# EAGLE board all (EAGLE 6.2), part 1 of 2
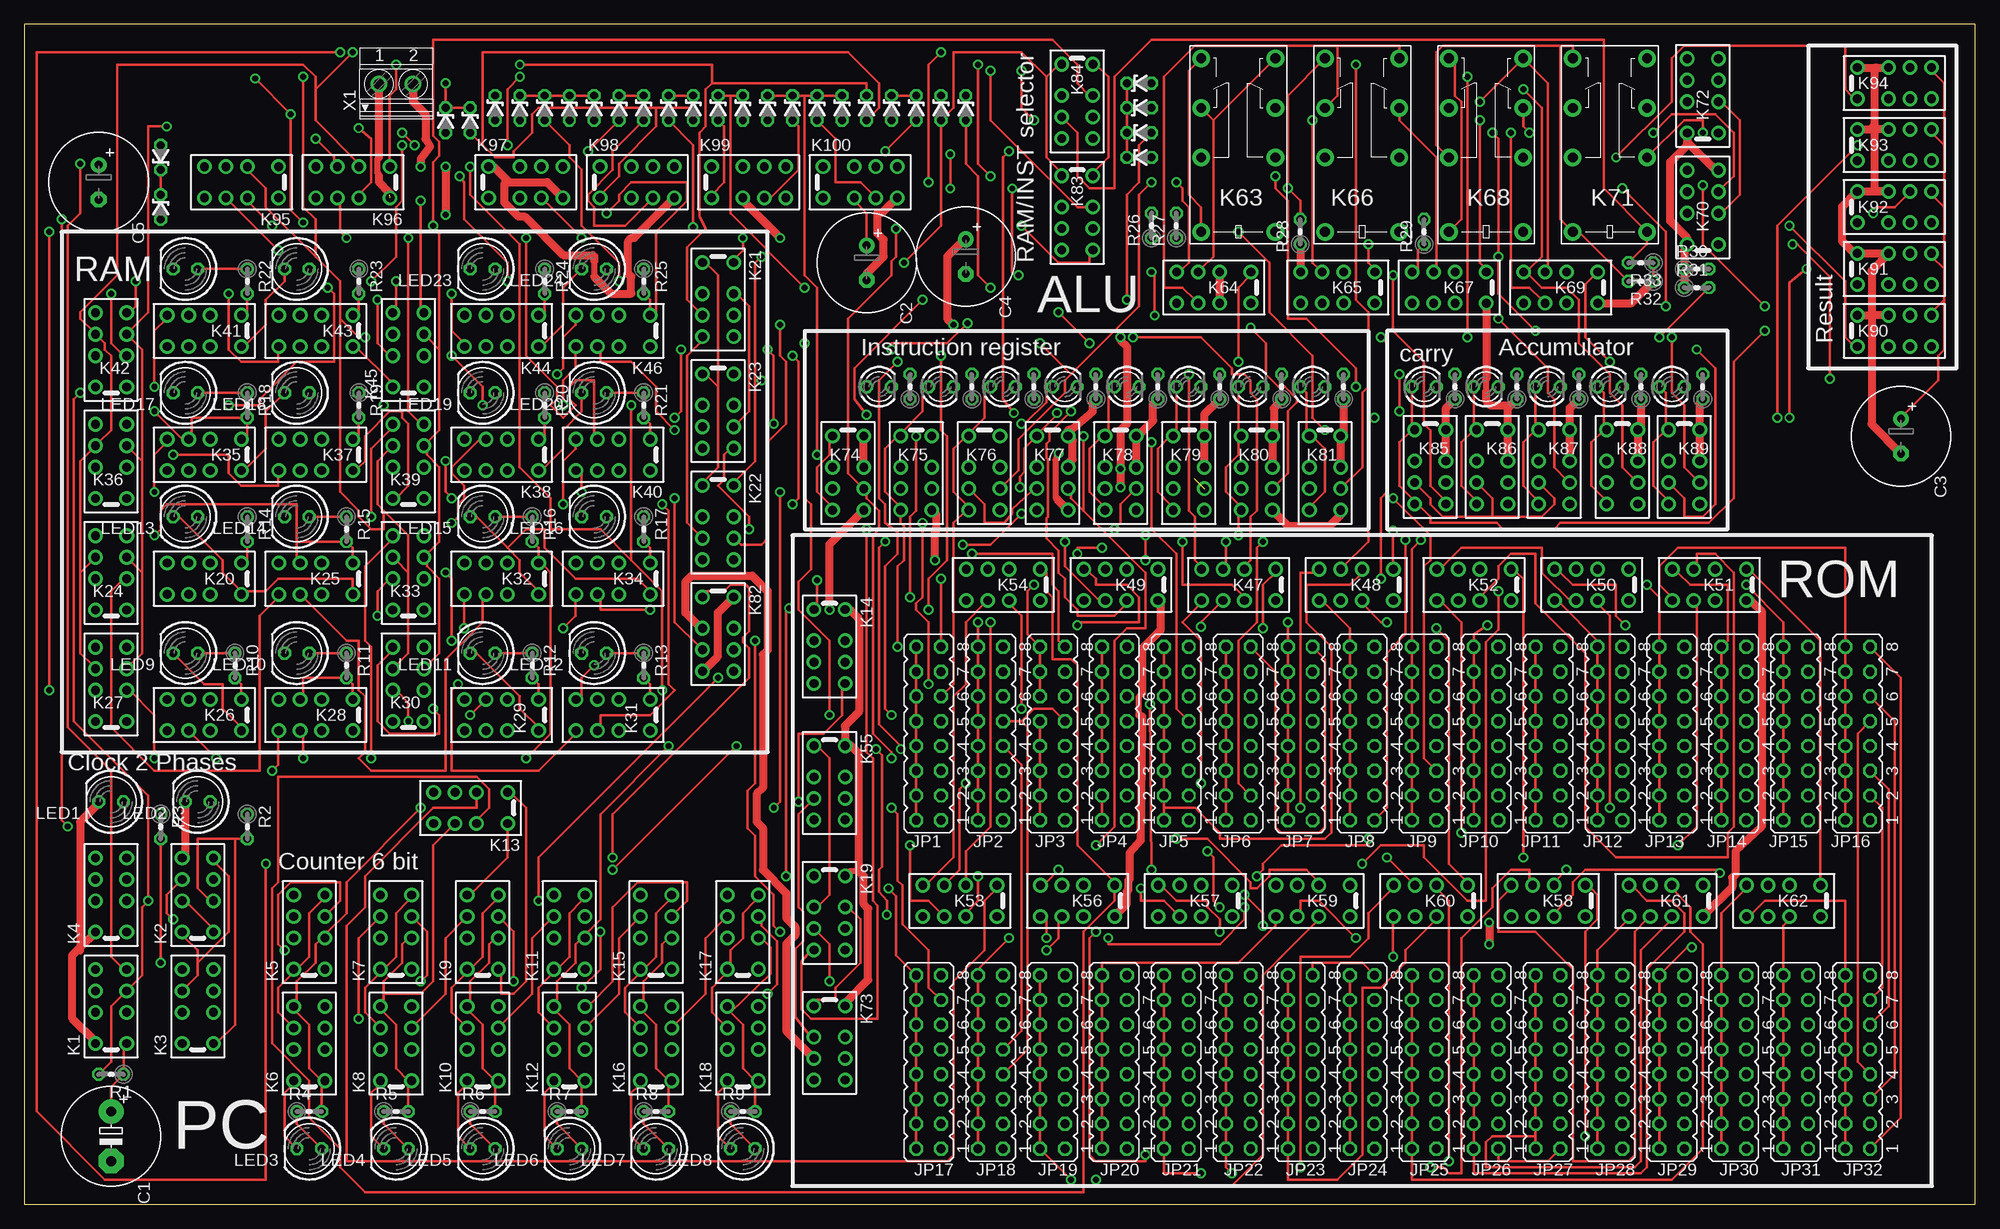
[diagram p6: board, top side]
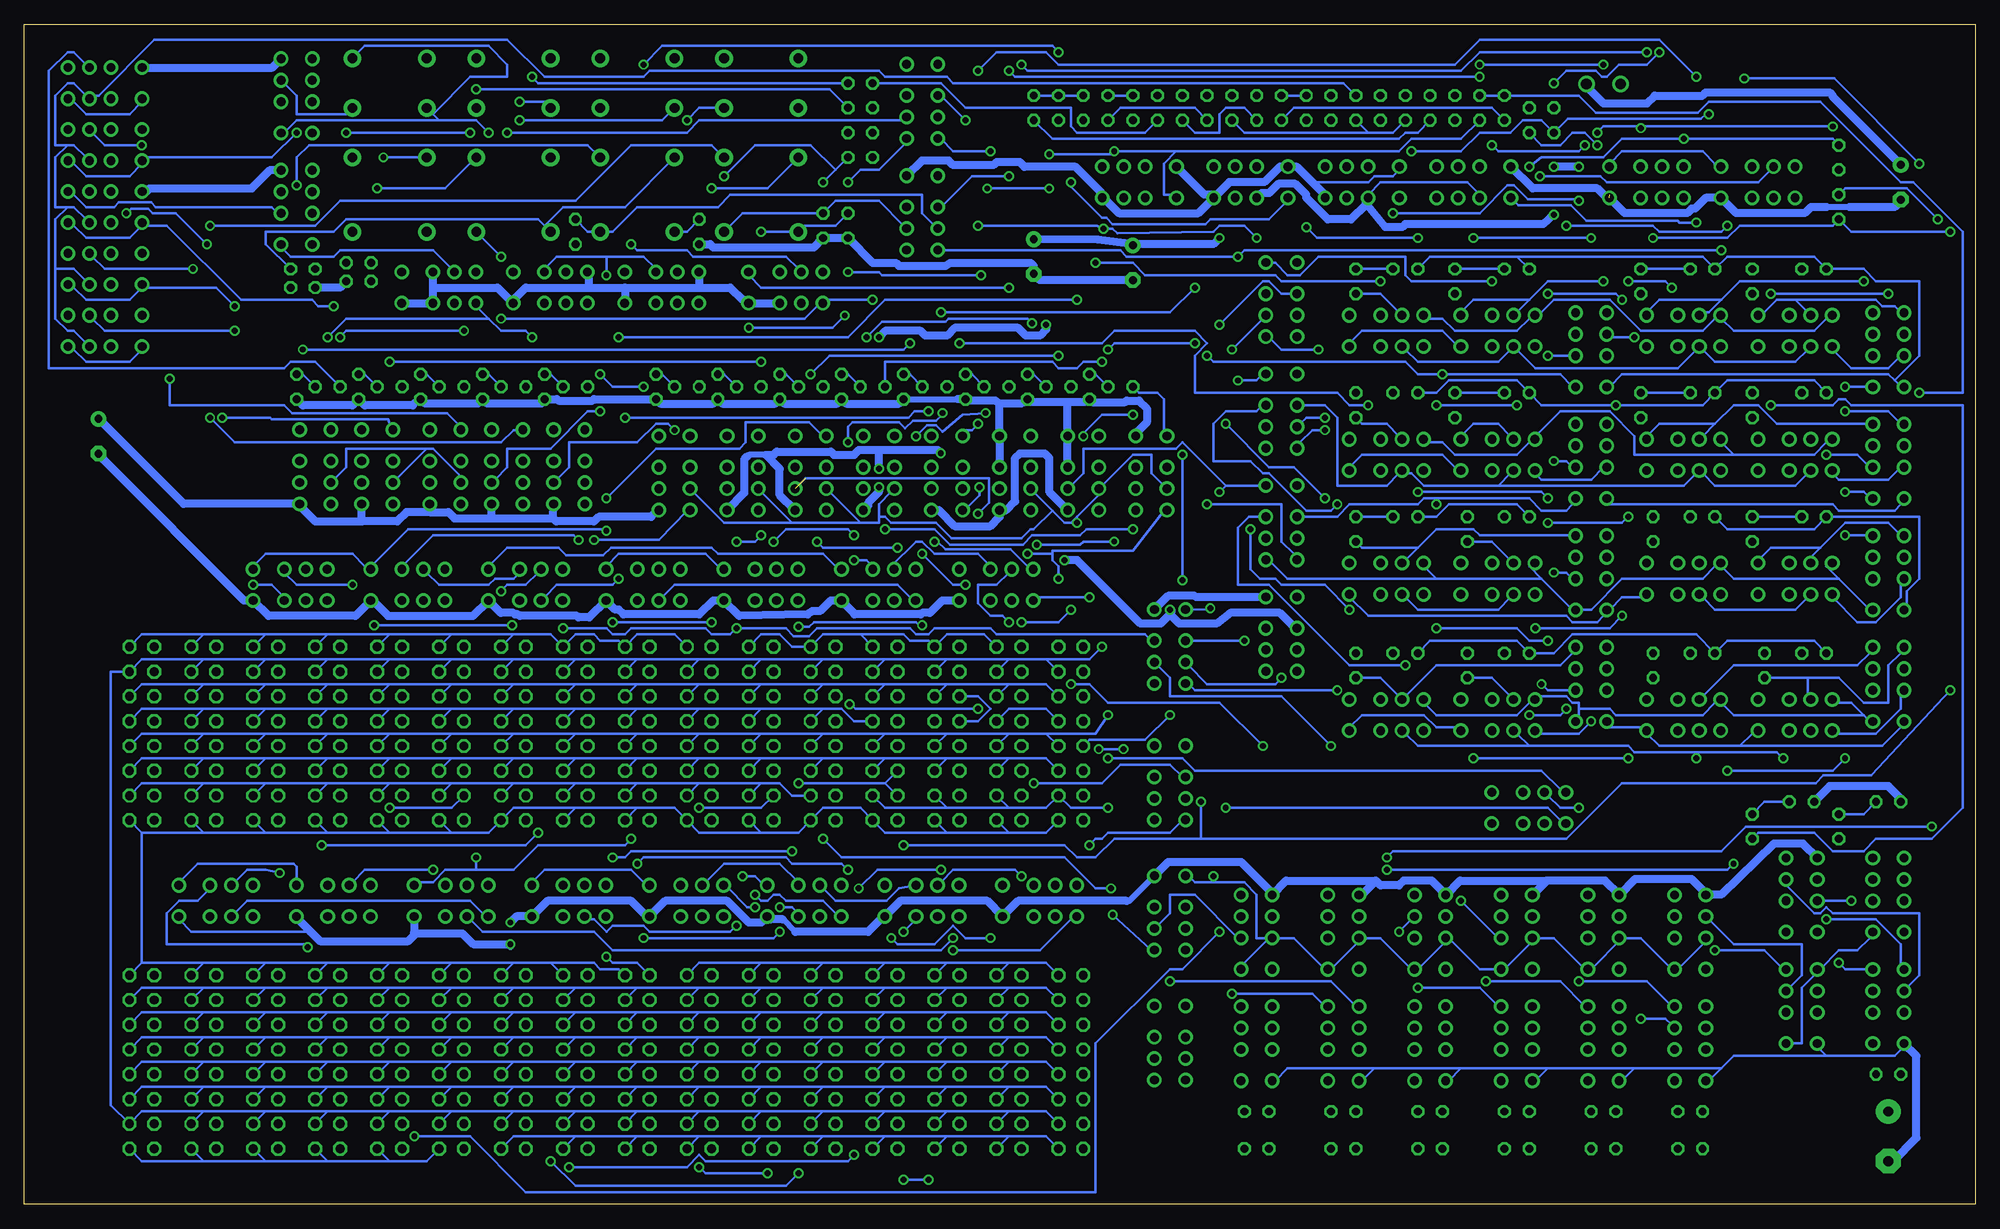
[diagram p7: board, bottom side, seen from below]

Size 200.01 x 120.95 mm. Coordinates in mm from the lower left corner, seen from the top.
Outline: 0,0 200.01,0 200.01,120.95 0,120.95 0,0
Copper layers (1*16): Top 0.035mm / dielectric 1.5mm / Bottom 0.035mm
Design rules: minimum track width 10mil, minimum drill 24mil, track to track 8mil, track to pad 8mil, pad to pad 8mil, via to via 8mil, smd to smd 8mil, copper to edge 40mil, drill to drill 8mil, minimum pad ring 10mil, minimum via ring 8mil, stop-mask expansion 4mil, vias tented up to drill 0mil, thermal gap 10mil

## Footprints (pad centres in the part's own frame; a part is rotated, then mirrored left to right if it is on the bottom)
E5-10,5 = drill 1.016 pad 2.54: + -2.54,0 | drill 1.016 pad 2.54 octagon: - 2.54,0
E3,5-10 = drill 0.813 pad 1.6: + -1.778,0 | drill 0.813 pad 1.6 octagon: - 1.778,0
ZDIO-2.5 = drill 0.813 octagon: A 1.27,0; C -1.27,0
JP8Q = drill 0.914 octagon: 1 -8.89,-1.27; 2 -8.89,1.27; 3 -6.35,-1.27; 4 -6.35,1.27; 5 -3.81,-1.27; 6 -3.81,1.27; 7 -1.27,-1.27; 8 -1.27,1.27; 9 1.27,-1.27; 10 1.27,1.27; 11 3.81,-1.27; 12 3.81,1.27; 13 6.35,-1.27; 14 6.35,1.27; 15 8.89,-1.27; 16 8.89,1.27
G6J-2P-Y = drill 0.9 pad 1.5: 1 -3.2,-1.6; 2 0,-1.6; 3 2.2,-1.6; 4 4.4,-1.6; 5 4.4,1.6; 6 2.2,1.6; 7 0,1.6; 8 -3.2,1.6
G5V-2 = drill 1 pad 1.8: 1 -8.89,-3.81; 4 -1.27,-3.81; 6 3.81,-3.81; 8 8.89,-3.81; 9 8.89,3.81; 11 3.81,3.81; 13 -1.27,3.81; 16 -8.89,3.81
LED5MM = drill 0.813 octagon: A -1.27,0; K 1.27,0
LED3MM = drill 0.813 octagon: A -1.27,0; K 1.27,0
0204V = drill 0.813 octagon: 1 -1.27,0; 2 1.27,0
1751248 = drill 1.1 pad 1.7: 1 -1.75,-0.1; 2 1.75,-0.1

## Placement (x,y rotation side)
C1  1000uF  [E5-10,5]  8.89,6.98 270 top
C2  1000uF  [E3,5-10]  86.36,96.52 270 top
C3  1000uF  [E3,5-10]  192.41,78.74 270 top
C4  1000uF  [E3,5-10]  96.52,97.16 270 top
C5  1000uF  [E3,5-10]  7.62,104.78 270 top
D1  1N4004VERTICALE  [ZDIO-2.5]  13.97,102.23 270 top
D2  1N4004VERTICALE  [ZDIO-2.5]  13.97,107.32 90 top
D3  1N4004VERTICALE  [ZDIO-2.5]  114.3,114.94 0 top
D4  1N4004VERTICALE  [ZDIO-2.5]  114.3,112.4 0 top
D5  1N4004VERTICALE  [ZDIO-2.5]  114.3,109.86 0 top
D6  1N4004VERTICALE  [ZDIO-2.5]  114.3,107.32 0 top
D29  1N4004VERTICALE  [ZDIO-2.5]  43.18,111.12 270 top
D30  1N4004VERTICALE  [ZDIO-2.5]  45.72,111.12 270 top
D31  1N4004VERTICALE  [ZDIO-2.5]  48.26,112.4 270 top
D32  1N4004VERTICALE  [ZDIO-2.5]  50.8,112.4 270 top
D33  1N4004VERTICALE  [ZDIO-2.5]  53.34,112.4 270 top
D34  1N4004VERTICALE  [ZDIO-2.5]  55.88,112.4 270 top
D35  1N4004VERTICALE  [ZDIO-2.5]  58.42,112.4 270 top
D36  1N4004VERTICALE  [ZDIO-2.5]  60.96,112.4 270 top
D37  1N4004VERTICALE  [ZDIO-2.5]  63.5,112.4 270 top
D38  1N4004VERTICALE  [ZDIO-2.5]  66.04,112.4 270 top
D39  1N4004VERTICALE  [ZDIO-2.5]  68.58,112.4 270 top
D40  1N4004VERTICALE  [ZDIO-2.5]  71.12,112.4 270 top
D41  1N4004VERTICALE  [ZDIO-2.5]  73.66,112.4 270 top
D42  1N4004VERTICALE  [ZDIO-2.5]  76.2,112.4 270 top
D43  1N4004VERTICALE  [ZDIO-2.5]  78.74,112.4 270 top
D44  1N4004VERTICALE  [ZDIO-2.5]  81.28,112.4 270 top
D45  1N4004VERTICALE  [ZDIO-2.5]  83.82,112.4 270 top
D46  1N4004VERTICALE  [ZDIO-2.5]  86.36,112.4 270 top
D47  1N4004VERTICALE  [ZDIO-2.5]  88.9,112.4 270 top
D48  1N4004VERTICALE  [ZDIO-2.5]  91.44,112.4 270 top
D49  1N4004VERTICALE  [ZDIO-2.5]  93.98,112.4 270 top
D50  1N4004VERTICALE  [ZDIO-2.5]  96.52,112.4 270 top
JP1  [JP8Q]  92.71,48.26 90 top
JP2  [JP8Q]  99.06,48.26 90 top
JP3  [JP8Q]  105.41,48.26 90 top
JP4  [JP8Q]  111.76,48.26 90 top
JP5  [JP8Q]  118.11,48.26 90 top
JP6  [JP8Q]  124.46,48.26 90 top
JP7  [JP8Q]  130.81,48.26 90 top
JP8  [JP8Q]  137.16,48.26 90 top
JP9  [JP8Q]  143.51,48.26 90 top
JP10  [JP8Q]  149.86,48.26 90 top
JP11  [JP8Q]  156.21,48.26 90 top
JP12  [JP8Q]  162.56,48.26 90 top
JP13  [JP8Q]  168.91,48.26 90 top
JP14  [JP8Q]  175.26,48.26 90 top
JP15  [JP8Q]  181.61,48.26 90 top
JP16  [JP8Q]  187.96,48.26 90 top
JP17  [JP8Q]  92.71,14.61 90 top
JP18  [JP8Q]  99.06,14.61 90 top
JP19  [JP8Q]  105.41,14.61 90 top
JP20  [JP8Q]  111.76,14.61 90 top
JP21  [JP8Q]  118.11,14.61 90 top
JP22  [JP8Q]  124.46,14.61 90 top
JP23  [JP8Q]  130.81,14.61 90 top
JP24  [JP8Q]  137.16,14.61 90 top
JP25  [JP8Q]  143.51,14.61 90 top
JP26  [JP8Q]  149.86,14.61 90 top
JP27  [JP8Q]  156.21,14.61 90 top
JP28  [JP8Q]  162.56,14.61 90 top
JP29  [JP8Q]  168.91,14.61 90 top
JP30  [JP8Q]  175.26,14.61 90 top
JP31  [JP8Q]  181.61,14.61 90 top
JP32  [JP8Q]  187.96,14.61 90 top
K1  G6J-2P-Y  [G6J-2P-Y]  8.89,19.69 90 top
K2  G6J-2P-Y  [G6J-2P-Y]  17.78,31.12 90 top
K3  G6J-2P-Y  [G6J-2P-Y]  17.78,19.69 90 top
K4  G6J-2P-Y  [G6J-2P-Y]  8.89,31.12 90 top
K5  G6J-2P-Y  [G6J-2P-Y]  29.21,27.31 90 top
K6  G6J-2P-Y  [G6J-2P-Y]  29.21,15.88 90 top
K7  G6J-2P-Y  [G6J-2P-Y]  38.1,27.31 90 top
K8  G6J-2P-Y  [G6J-2P-Y]  38.1,15.88 90 top
K9  G6J-2P-Y  [G6J-2P-Y]  46.99,27.31 90 top
K10  G6J-2P-Y  [G6J-2P-Y]  46.99,15.88 90 top
K11  G6J-2P-Y  [G6J-2P-Y]  55.88,27.31 90 top
K12  G6J-2P-Y  [G6J-2P-Y]  55.88,15.88 90 top
K13  G6J-2P-Y  [G6J-2P-Y]  46.36,40.64 180 top
K14  G6J-2P-Y  [G6J-2P-Y]  82.55,57.78 270 top
K15  G6J-2P-Y  [G6J-2P-Y]  64.77,27.31 90 top
K16  G6J-2P-Y  [G6J-2P-Y]  64.77,15.88 90 top
K17  G6J-2P-Y  [G6J-2P-Y]  73.66,27.31 90 top
K18  G6J-2P-Y  [G6J-2P-Y]  73.66,15.88 90 top
K19  G6J-2P-Y  [G6J-2P-Y]  82.55,30.48 270 top
K20  G6J-2P-Y  [G6J-2P-Y]  19.05,64.14 180 top
K21  G6J-2P-Y  [G6J-2P-Y]  71.12,93.34 270 top
K22  G6J-2P-Y  [G6J-2P-Y]  71.12,70.48 270 top
K23  G6J-2P-Y  [G6J-2P-Y]  71.12,81.92 270 top
K24  G6J-2P-Y  [G6J-2P-Y]  8.89,64.14 90 top
K25  G6J-2P-Y  [G6J-2P-Y]  30.48,64.14 180 top
K26  G6J-2P-Y  [G6J-2P-Y]  19.05,50.16 180 top
K27  G6J-2P-Y  [G6J-2P-Y]  8.89,52.7 90 top
K28  G6J-2P-Y  [G6J-2P-Y]  30.48,50.16 180 top
K29  G6J-2P-Y  [G6J-2P-Y]  49.53,50.16 180 top
K30  G6J-2P-Y  [G6J-2P-Y]  39.37,52.7 90 top
K31  G6J-2P-Y  [G6J-2P-Y]  60.96,50.16 180 top
K32  G6J-2P-Y  [G6J-2P-Y]  49.53,64.14 180 top
K33  G6J-2P-Y  [G6J-2P-Y]  39.37,64.14 90 top
K34  G6J-2P-Y  [G6J-2P-Y]  60.96,64.14 180 top
K35  G6J-2P-Y  [G6J-2P-Y]  19.05,76.84 180 top
K36  G6J-2P-Y  [G6J-2P-Y]  8.89,75.57 90 top
K37  G6J-2P-Y  [G6J-2P-Y]  30.48,76.84 180 top
K38  G6J-2P-Y  [G6J-2P-Y]  49.53,76.84 180 top
K39  G6J-2P-Y  [G6J-2P-Y]  39.37,75.57 90 top
K40  G6J-2P-Y  [G6J-2P-Y]  60.96,76.84 180 top
K41  G6J-2P-Y  [G6J-2P-Y]  19.05,89.54 180 top
K42  G6J-2P-Y  [G6J-2P-Y]  8.89,87 90 top
K43  G6J-2P-Y  [G6J-2P-Y]  30.48,89.54 180 top
K44  G6J-2P-Y  [G6J-2P-Y]  49.53,89.54 180 top
K45  G6J-2P-Y  [G6J-2P-Y]  39.37,87 90 top
K46  G6J-2P-Y  [G6J-2P-Y]  60.96,89.54 180 top
K47  G6J-2P-Y  [G6J-2P-Y]  125.09,63.5 180 top
K48  G6J-2P-Y  [G6J-2P-Y]  137.16,63.5 180 top
K49  G6J-2P-Y  [G6J-2P-Y]  113.03,63.5 180 top
K50  G6J-2P-Y  [G6J-2P-Y]  161.29,63.5 180 top
K51  G6J-2P-Y  [G6J-2P-Y]  173.36,63.5 180 top
K52  G6J-2P-Y  [G6J-2P-Y]  149.23,63.5 180 top
K53  G6J-2P-Y  [G6J-2P-Y]  96.52,31.12 180 top
K54  G6J-2P-Y  [G6J-2P-Y]  100.96,63.5 180 top
K55  G6J-2P-Y  [G6J-2P-Y]  82.55,43.81 270 top
K56  G6J-2P-Y  [G6J-2P-Y]  108.58,31.12 180 top
K57  G6J-2P-Y  [G6J-2P-Y]  120.65,31.12 180 top
K58  G6J-2P-Y  [G6J-2P-Y]  156.84,31.12 180 top
K59  G6J-2P-Y  [G6J-2P-Y]  132.72,31.12 180 top
K60  G6J-2P-Y  [G6J-2P-Y]  144.78,31.12 180 top
K61  G6J-2P-Y  [G6J-2P-Y]  168.91,31.12 180 top
K62  G6J-2P-Y  [G6J-2P-Y]  180.98,31.12 180 top
K63  G5V-2  [G5V-2]  124.46,108.59 90 top
K64  G6J-2P-Y  [G6J-2P-Y]  122.55,93.98 180 top
K65  G6J-2P-Y  [G6J-2P-Y]  135.26,93.98 180 top
K66  G5V-2  [G5V-2]  137.16,108.59 90 top
K67  G6J-2P-Y  [G6J-2P-Y]  146.69,93.98 180 top
K68  G5V-2  [G5V-2]  149.86,108.59 90 top
K69  G6J-2P-Y  [G6J-2P-Y]  158.12,93.98 180 top
K70  G6J-2P-Y  [G6J-2P-Y]  172.09,101.6 90 top
K71  G5V-2  [G5V-2]  162.56,108.59 90 top
K72  G6J-2P-Y  [G6J-2P-Y]  172.09,113.03 90 top
K73  G6J-2P-Y  [G6J-2P-Y]  82.55,17.15 270 top
K74  G6J-2P-Y  [G6J-2P-Y]  84.45,75.57 270 top
K75  G6J-2P-Y  [G6J-2P-Y]  91.44,75.57 270 top
K76  G6J-2P-Y  [G6J-2P-Y]  98.42,75.57 270 top
K77  G6J-2P-Y  [G6J-2P-Y]  105.41,75.57 270 top
K78  G6J-2P-Y  [G6J-2P-Y]  112.39,75.57 270 top
K79  G6J-2P-Y  [G6J-2P-Y]  119.38,75.57 270 top
K80  G6J-2P-Y  [G6J-2P-Y]  126.36,75.57 270 top
K81  G6J-2P-Y  [G6J-2P-Y]  133.35,75.57 270 top
K82  G6J-2P-Y  [G6J-2P-Y]  71.12,59.05 270 top
K83  G6J-2P-Y  [G6J-2P-Y]  107.95,102.23 270 top
K84  G6J-2P-Y  [G6J-2P-Y]  107.95,113.67 270 top
K85  G6J-2P-Y  [G6J-2P-Y]  144.15,76.2 270 top
K86  G6J-2P-Y  [G6J-2P-Y]  150.5,76.2 270 top
K87  G6J-2P-Y  [G6J-2P-Y]  156.84,76.2 270 top
K88  G6J-2P-Y  [G6J-2P-Y]  163.83,76.2 270 top
K89  G6J-2P-Y  [G6J-2P-Y]  170.18,76.2 270 top
K90  G6J-2P-Y  [G6J-2P-Y]  191.14,89.54 0 top
K91  G6J-2P-Y  [G6J-2P-Y]  191.14,95.89 0 top
K92  G6J-2P-Y  [G6J-2P-Y]  191.14,102.23 0 top
K93  G6J-2P-Y  [G6J-2P-Y]  191.14,108.59 0 top
K94  G6J-2P-Y  [G6J-2P-Y]  191.14,114.94 0 top
K95  G6J-2P-Y  [G6J-2P-Y]  22.86,104.78 180 top
K96  G6J-2P-Y  [G6J-2P-Y]  34.29,104.78 180 top
K97  G6J-2P-Y  [G6J-2P-Y]  50.8,104.78 0 top
K98  G6J-2P-Y  [G6J-2P-Y]  62.23,104.78 0 top
K99  G6J-2P-Y  [G6J-2P-Y]  73.66,104.78 0 top
K100  G6J-2P-Y  [G6J-2P-Y]  85.09,104.78 0 top
LED1  [LED5MM]  8.89,41.27 180 top
LED2  [LED5MM]  17.78,41.27 180 top
LED3  [LED5MM]  29.21,5.71 180 top
LED4  [LED5MM]  38.1,5.71 180 top
LED5  [LED5MM]  46.99,5.71 180 top
LED6  [LED5MM]  55.88,5.71 180 top
LED7  [LED5MM]  64.77,5.71 180 top
LED8  [LED5MM]  73.66,5.71 180 top
LED9  [LED5MM]  16.51,56.52 180 top
LED10  [LED5MM]  27.94,56.52 180 top
LED11  [LED5MM]  46.99,56.52 180 top
LED12  [LED5MM]  58.42,56.52 180 top
LED13  [LED5MM]  16.51,70.48 180 top
LED14  [LED5MM]  27.94,70.48 180 top
LED15  [LED5MM]  46.99,70.48 180 top
LED16  [LED5MM]  58.42,70.48 180 top
LED17  [LED5MM]  16.51,83.19 180 top
LED18  [LED5MM]  27.94,83.19 180 top
LED19  [LED5MM]  46.99,83.19 180 top
LED20  [LED5MM]  58.42,83.19 180 top
LED21  [LED5MM]  16.51,95.89 180 top
LED22  [LED5MM]  27.94,95.89 180 top
LED23  [LED5MM]  46.99,95.89 180 top
LED24  [LED5MM]  58.42,95.89 180 top
LED25  [LED3MM]  87.63,83.82 0 top
LED26  [LED3MM]  93.98,83.82 0 top
LED27  [LED3MM]  100.33,83.82 0 top
LED28  [LED3MM]  106.68,83.82 0 top
LED29  [LED3MM]  113.03,83.82 0 top
LED30  [LED3MM]  119.38,83.82 0 top
LED31  [LED3MM]  125.73,83.82 0 top
LED32  [LED3MM]  132.08,83.82 0 top
LED33  [LED3MM]  143.51,83.82 0 top
LED34  [LED3MM]  149.86,83.82 0 top
LED35  [LED3MM]  156.21,83.82 0 top
LED36  [LED3MM]  162.56,83.82 0 top
LED37  [LED3MM]  168.91,83.82 0 top
R1  [0204V]  8.89,13.33 180 top
R2  [0204V]  22.86,38.73 270 top
R3  [0204V]  13.97,38.73 270 top
R4  [0204V]  29.21,9.53 0 top
R5  [0204V]  38.1,9.53 0 top
R6  [0204V]  46.99,9.53 0 top
R7  [0204V]  55.88,9.53 0 top
R8  [0204V]  64.77,9.53 0 top
R9  [0204V]  73.66,9.53 0 top
R10  [0204V]  21.59,55.24 270 top
R11  [0204V]  33.02,55.24 270 top
R12  [0204V]  52.07,55.24 270 top
R13  [0204V]  63.5,55.24 270 top
R14  [0204V]  22.86,69.22 270 top
R15  [0204V]  33.02,69.22 270 top
R16  [0204V]  52.07,69.22 270 top
R17  [0204V]  63.5,69.22 270 top
R18  [0204V]  22.86,81.92 270 top
R19  [0204V]  34.29,81.92 270 top
R20  [0204V]  53.34,81.92 270 top
R21  [0204V]  63.5,81.92 270 top
R22  [0204V]  22.86,94.62 270 top
R23  [0204V]  34.29,94.62 270 top
R24  [0204V]  53.34,94.62 270 top
R25  [0204V]  63.5,94.62 270 top
R26  [0204V]  115.57,100.33 90 top
R27  [0204V]  118.11,100.33 90 top
R28  [0204V]  130.81,99.7 90 top
R29  [0204V]  143.51,99.7 90 top
R30  [0204V]  171.45,95.89 0 top
R31  [0204V]  171.45,93.98 0 top
R32  [0204V]  165.74,94.62 180 top
R33  [0204V]  165.74,96.52 180 top
R34  [0204V]  90.8,83.82 90 top
R35  [0204V]  97.16,83.82 90 top
R36  [0204V]  103.5,83.82 90 top
R37  [0204V]  109.85,83.82 90 top
R38  [0204V]  116.2,83.82 90 top
R39  [0204V]  122.55,83.82 90 top
R40  [0204V]  128.91,83.82 90 top
R41  [0204V]  135.26,83.82 90 top
R42  [0204V]  146.69,83.82 90 top
R43  [0204V]  153.03,83.82 90 top
R44  [0204V]  159.39,83.82 90 top
R45  [0204V]  165.74,83.82 90 top
R46  [0204V]  172.09,83.82 90 top
X1  1751248  [1751248]  38.1,114.94 0 top

## Tracks (layer width: path | path; a pad name or v marks a point on that pad's centre or on a via)
A_B_SELECTOR  (via drill 0.61)
  Top 0.254: 104.77,115.57 104.77,107.32 106.05,106.05 K83.1 | 104.77,115.57 106.05,116.84 K84.1 | D33.A 55.88,108.59 55.88,107.32 57.15,106.05 57.15,100.33 60.96,96.52 v60.96,94.62 | v90.17,96.52 93.98,100.33 D49.A 95.25,112.4 95.25,118.11 102.23,118.11 104.77,115.57
  Bottom 0.254: v60.96,94.62 71.12,94.62 71.75,95.25 85.09,95.25 86.36,96.52 v90.17,96.52
CLK1  (via drill 0.61)
  Top 0.254: v13.97,24.77 R3.2 | D36.A v57.79,107.95 | v28.57,100.65 27.3,101.92 v27.3,111.76 v23.65,115.41 | v5.71,106.68 5.71,101.6 4.45,100.33 4.45,48.89 8.89,44.45 8.89,25.4 10.16,24.13 K1.4
  Bottom 0.254: v13.97,24.77 13.33,24.13 10.79,24.13 K1.4 | v57.79,107.95 52.71,107.95 50.8,109.86 47.62,109.86 46.36,111.12 44.45,111.12 D29.A 41.75,111.28 28.1,111.28 27.62,111.76 v27.3,111.76 | v28.57,100.65 30.32,100.65 30.48,100.81 39.85,100.81 41.43,102.39 46.83,102.39 K97.1 | v5.71,106.68 14.45,115.41 v23.65,115.41
CLK2  (via drill 0.61)
  Top 0.254: 21.59,37.46 17.78,37.46 17.78,32.38 19.05,31.12 K2.2 | 21.59,37.46 R2.2 | 21.59,37.46 21.59,18.42 19.68,16.51 K3.1 | 46.99,108.59 48.26,107.32 50.17,107.32 50.17,107.95 52.07,109.86 52.07,111.76 52.71,112.4 64.77,112.4 | 46.99,108.59 D30.A | 64.77,112.4 68.58,112.4 D39.A | D46.A 87.63,112.4 87.63,114.94 84.45,118.11 46.99,118.11 46.99,108.59 | 64.77,112.4 64.77,110.49 60.96,106.68 60.96,105.41 59.05,103.51 K98.1 | v20.95,81.92 24.13,81.92 24.13,82.55 27.94,86.36 31.75,86.36 31.75,93.34 v31.11,93.98 | v35.56,94.62 38.1,97.16 38.1,102.23 38.74,102.87 v38.74,108.59
  Bottom 0.254: K4.1 10.79,27.31 12.06,26.04 13.97,26.04 15.88,24.13 K3.5 16.51,23.5 17.78,22.23 17.78,16.51 19.05,16.51 K3.1 | R2.2 22.22,38.1 16.51,38.1 14.61,36.2 11.43,36.2 10.16,37.46 4.45,37.46 1.27,40.64 1.27,81.92 12.7,81.92 13.33,82.55 13.97,82.55 14.61,81.92 v20.95,81.92 | v31.11,93.98 31.75,94.62 v35.56,94.62 | v38.74,108.59 40.01,109.86 41.28,109.86 42.55,108.59 44.45,108.59 D30.A
GND  (via drill 0.6)  (1 unrouted)
  Top 0.254: 16.51,35.56 K2.5 | LED8.K 71.12,6.98 71.12,11.43 71.75,12.06 K18.8 | LED7.K 62.23,6.98 62.23,11.43 62.87,12.06 K16.8 | LED6.K 53.34,6.98 53.34,11.43 53.98,12.06 K12.8 | LED5.K 44.45,6.98 44.45,11.43 45.09,12.06 K10.8 | LED4.K 35.56,6.98 35.56,11.43 36.2,12.06 K8.8 | LED3.K 26.67,6.98 26.67,11.43 27.3,12.06 K6.8 | K9.5 45.72,31.75 49.53,35.56 49.53,38.73 K13.8 | 85.72,45.72 85.57,45.88 85.57,46.19 | K83.8 109.85,106.05 111.12,107.32 111.12,115.57 109.85,116.84 K84.8 | 173.36,106.05 K70.4 | 189.55,110.49 189.23,110.49 | R33.1 R32.1 | R29.1 142.88,97.79 142.88,95.89 K67.4
  Top 0.61: 58.42,96.68 58.42,95.09 | 36.35,105.41 36.35,105.57 36.2,105.73 36.2,107.16 36.35,107.32 | 114.3,50.16 114.3,52.07 114.62,52.39 | 149.86,84.61 149.86,83.34 | 85.57,34.13 84.6,34.13 K19.8
  Top 0.813: K1.8 7.29,16.68 4.92,19.05 4.92,25.55 5.48,26.11 | 5.48,26.11 5.72,26.35 | 5.72,26.35 K4.8 | 5.71,26.04 5.56,26.04 5.48,26.11 | LED1.K 7.62,41.12 5.71,39.21 5.71,26.35 5.72,26.35 | LED2.K 16.51,35.84 K2.5 16.23,35.56 16.51,35.56 | 189.39,91.28 189.39,95.73 191.14,97.47 K91.7 K91.8 187.63,97.48 186.37,98.74 186.37,102.27 K92.8 K92.7 189.88,103.84 189.87,103.82 189.71,103.82 189.71,110.17 | 189.39,91.28 189.39,79.98 C3.- | K90.8 189.24,91.14 189.39,91.28 | K90.7 189.53,91.14 189.39,91.28 | 189.71,110.17 189.71,110.33 | 189.71,110.33 189.55,110.49 | K94.8 189.87,116.54 | 189.87,116.54 K94.7 | 189.71,110.33 189.71,116.38 189.87,116.54 | K93.7 189.72,110.19 189.71,110.17 | K93.8 189.69,110.19 189.71,110.17 | 173.36,106.05 170.66,108.74 | 170.66,108.74 170.49,108.92 K72.8 | 170.66,108.74 168.75,106.84 168.75,100.81 170.49,99.07 K70.8 170.49,98.09 170.18,97.79 R30.1 R31.1 | K69.8 164.77,92.38 R32.1 | K64.7 K64.2 | R28.1 130.81,95.62 K65.4 | K97.8 48.09,106.38 49.53,104.93 | 49.53,104.93 49.21,104.62 49.21,102.71 50.64,101.28 51.28,101.28 55.25,97.31 58.26,97.31 58.42,97.16 58.42,96.68 | 49.53,104.93 49.53,104.78 53.6,104.78 K97.4 | 58.42,95.09 60.17,93.34 62.23,93.34 62.23,95.09 61.91,95.41 61.91,98.74 62.23,99.06 62.52,99.06 K98.4 | 37.47,103.51 37.47,103.66 36.35,104.78 36.35,105.41 | 36.35,107.32 X1.1 | C2.- 86.36,95.41 88.11,97.16 88.11,98.9 87.47,99.54 87.47,101.6 87.79,101.6 87.87,101.68 87.99,101.68 K100.4 | K51.8 177.02,61.9 178.12,60.8 178.12,38.73 175.42,36.2 175.42,33.81 175.1,33.5 175.1,32.51 K61.8 | v150.18,28.89 v150.18,26.67 | K56.8 111.78,29.55 113.03,30.8 113.03,32.07 113.19,32.23 113.19,33.18 113.35,33.34 113.35,36.04 114.46,37.31 114.62,49.53 114.62,50.01 114.3,50.16
  Top 0.813: 114.62,52.39 114.62,56.99 116.52,58.9 116.52,61.61 K49.8 | K67.8 149.89,84.64 149.86,84.61 | 149.86,83.34 149.86,82.39 150.34,81.92 152.4,81.92 | 152.4,81.92 R43.1 | K89.7 K89.8 171.78,82.25 R46.1 | R45.1 165.74,79.7 K88.8 K88.7 | K87.7 K87.8 158.45,81.61 R44.1 | K86.7 K86.8 152.09,81.61 152.4,81.92 | K85.7 K85.8 145.75,81.61 R42.1 | R41.1 135.26,79.07 K81.8 K81.7 | R40.1 128.91,82.39 128.11,81.6 128.11,78.91 K80.8 K80.7 | K79.7 K79.8 120.98,80.98 R39.1 | K78.7 K78.8 114.17,78.77 115.73,80.33 115.73,82.07 R38.1 | K77.7 107.01,75.9 107.47,76.36 107.47,78.3 K77.8 107.01,79.39 107.49,79.55 109.54,81.28 109.54,82.23 R37.1 | K74.7 K74.8 | 85.57,45.88 85.57,34.13 86.04,33.66 86.04,30.8 86.52,30.32 86.52,23.02 84.3,20.8 84.3,20.49 K73.8 | 85.57,46.19 84.75,47.02 K55.8 84.14,47.03 84.14,49.05 85.57,50.48 85.57,60.01 84.59,60.98 K14.8 | K82.4 69.58,54.66 71.12,56.2 71.12,60.66 K82.8
  Bottom 0.254: 15.24,15.24 8.26,15.24 7.62,15.88 K1.8 | 15.24,15.24 15.88,15.88 K3.8 | 26.04,13.97 24.77,15.24 15.24,15.24 | 26.04,13.97 27.3,12.7 K6.8 | 34.93,13.97 36.2,12.7 K8.8 | 26.04,13.97 34.93,13.97 | 43.82,13.97 45.09,12.7 K10.8 | 34.93,13.97 43.82,13.97 | 52.71,13.97 53.98,12.7 K12.8 | 43.82,13.97 52.71,13.97 | 61.6,13.97 62.87,12.7 K16.8 | 52.71,13.97 61.6,13.97 | 61.6,13.97 70.48,13.97 71.75,12.7 K18.8 | 116.2,61.59 K49.8 | 140.34,61.59 K48.8 | 128.27,61.59 K47.8 | 170.66,27.94 182.88,27.94 184.15,29.21 K62.8 | 164.47,61.59 K50.8 | 176.53,61.59 K51.8 | 192.41,76.84 C3.- | 152.4,61.59 K52.8 | 78.1,103.51 K99.4 | 67.94,104.78 62.23,104.78 61.6,105.41 59.69,105.41 59.05,106.05 K98.8 | 96.52,95.25 C4.- | 89.53,103.51 K100.4 | 149.86,92.71 K67.8 | 140.34,93.98 138.43,93.98
  Bottom 0.61: 120.97,27.94 122.24,29.21 | 12.86,102.23 15.24,102.23 | 109.7,82.55 104.3,82.55 | 86.99,31.12 86.71,31.12 K19.8
  Bottom 0.813: C1.- 8.41,4.45 6.03,6.83 6.03,15.23 K1.8 | LED1.K 7.62,41.59 8.89,42.86 14.92,42.86 LED2.K | K2.5 17.65,36.99 20.64,36.99 26.04,31.75 27.57,31.75 K5.5 27.61,31.9 29.05,33.34 34.87,33.34 K7.5 36.5,31.74 37.94,33.18 43.82,33.18 | 43.82,33.18 43.92,33.18 | 43.92,33.18 44.1,32.99 | 44.1,32.99 K9.5 | 43.92,33.18 52.81,33.18 K11.5 54.28,31.74 55.72,33.18 58.58,33.18 59.05,32.7 60.96,32.7 61.44,33.18 | 43.82,33.18 44.1,32.99 | K15.5 62.91,31.71 61.44,33.18 | 61.44,33.18 70.64,33.18 72.06,31.76 K17.5 72.06,31.9 75.25,35.08 82.75,35.08 K19.8 | 86.99,31.12 98.12,31.12 K53.8 99.72,29.55 101.28,31.12 110.19,31.12 K56.8 111.93,29.52 113.51,27.94 120.97,27.94 | 122.24,29.21 123.55,29.21 K57.8 123.85,29.5 124.46,28.89 125.73,28.89 127.95,31.12 134.31,31.12 K59.8 136.2,29.52 137.8,31.12 146.37,31.12 147.16,30.32 147.97,29.53 | C3.- 191.93,76.49 191.93,76.36 177.47,61.9 K51.8 174.98,60.32 166.05,60.32 164.49,61.89 K50.8 | 164.47,61.59 163.99,61.59 162.72,60.32 154,60.32 K52.8 151.17,60.64 149.86,60.64 149.7,60.48 149.38,60.48 149.23,60.32 143.35,60.32 143.19,60.17 142.08,60.17 140.36,61.89 K48.8 139.42,60.96 139.06,60.96 138.59,60.48 130.81,60.48 129.39,61.9 K47.8 126.72,60.32 119.7,60.48 119.22,60.8 118.43,60.8 117.33,61.9 K49.8 114.94,60.6 114.94,60.48 108.11,60.48 107.95,60.64 107.16,60.64 105.9,61.9 K54.8 | K94.8 174.58,116.54 K72.4 | K92.8 187.47,103.84 187.17,104.14 176.69,104.14 174.78,106.05 173.73,106.05 K70.4 | R32.1 167.64,93.98 R31.1 | K69.8 K69.7 158.12,93.98 | 158.12,93.98 K69.2 | 158.12,93.98 151.49,93.98 K67.8 | 149.86,92.71 148.59,93.98 142.08,93.98
  Bottom 0.813: 142.08,93.98 142.08,95.38 K67.4 | 142.08,93.98 138.43,93.98 | 138.43,93.98 138.43,92.41 K65.8 | 138.43,93.98 130.97,93.98 | 130.97,93.98 127.63,93.98 126.36,92.71 126.08,92.71 K64.8 K64.7 | K65.4 130.86,94.09 130.97,93.98 | R28.1 129.7,98.43 129.38,98.11 119.06,98.11 R27.1 R26.1 113.03,96.52 110.65,96.52 110.33,96.2 105.57,96.2 105.09,96.52 96.84,96.52 96.52,96.2 C4.- 95.88,94.74 C2.- | C5.- 7.62,102.87 8.26,102.23 12.86,102.23 | 15.24,102.23 16.83,102.23 17.46,101.6 24.48,101.6 K95.8 27.63,103.18 28.73,102.08 29.05,102.08 29.53,101.6 35.92,101.6 K96.8 37.77,103.18 38.74,104.14 45.37,104.14 K97.8 | K98.4 66.63,103.46 67.94,104.78 69.53,106.36 70.45,106.36 K99.8 71.27,106.38 72.87,104.78 76.46,104.78 K99.4 79.63,101.6 87.79,101.6 89.36,103.18 K100.4 | 78.1,103.51 79.02,103.51 K100.8 | K61.8 172.11,29.39 170.66,27.94 169.7,26.99 160.66,26.99 159.86,27.78 | K58.8 160.05,27.81 160.02,27.78 159.86,27.78 | 159.86,27.78 155.1,27.78 153.99,26.67 v150.18,26.67 150.18,26.51 | K60.8 149.56,29.52 v150.18,28.89 | 89.53,103.51 89.53,103.66 92.23,106.36 97.47,106.36 97.95,106.84 100.33,106.84 100.65,106.52 104.77,106.52 105.25,107 107.99,107 K83.8 | R46.1 171.45,81.92 166.37,81.92 R45.1 165.1,81.92 160.18,81.92 159.54,82.55 R44.1 158.91,82.07 153.51,82.07 R43.1 152.56,82.07 147,82.07 146.69,82.39 R42.1 145.42,82.55 145.26,82.39 141.76,82.39 141.61,82.55 R41.1 134.78,82.07 129.38,82.07 R40.1 128.43,82.07 123.03,82.07 R39.1 122.08,82.07 116.68,82.07 R38.1 115.73,82.07 110.33,82.07 R37.1 109.7,82.55 | 100.01,82.07 97.79,82.07 97.31,82.55 R35.1 96.84,82.23 93.03,82.23
  Bottom 0.813: 100.01,82.07 100.49,82.39 103.35,82.39 R36.1 104.3,82.55 | 100.01,82.07 100.02,82.06 K76.8 K76.7 | K75.7 K75.8 93.04,82.22 93.03,82.23 | 93.03,82.23 91.28,82.23 90.96,82.55 R34.1 90.49,82.23 87.15,82.23 86.99,82.39 85.72,82.39 84.93,81.6 84.93,80.17 86.04,79.06 86.04,78.78 K74.8 | K82.8 79.88,62.25 80.01,62.39 82.75,62.39 K14.8
HCF-  (via drill 0.61)
  Top 0.254: D32.C D33.C D34.C D35.C | K2.7 16.51,31.12 19.05,28.58 19.05,27.94 K2.1 | R1.2 8.89,14.61 8.89,20.32 10.16,21.59 K1.3 10.79,22.23 12.06,23.5 12.06,30.48 v12.7,31.12 12.7,41.91 5.08,49.53 5.08,82.55 v5.71,83.19
  Bottom 0.254: D32.C D31.C 40.64,113.67 38.89,111.92 28.42,111.92 27.3,113.03 15.88,113.03 7.62,104.78 6.35,104.78 1.27,99.7 1.27,83.19 v5.71,83.19 | v12.7,31.12 K2.7
INSTR4  (via drill 0.61)
  Top 0.254: v86.36,69.22 86.36,46.35 86.99,45.72 86.99,31.12 87.47,30.64 87.47,19.05 80.64,19.05 79.69,20 79.69,24.92 80.64,26.04 K19.4 | v111.76,69.22 112.39,69.85 112.39,71.76 113.66,73.03 K78.6
  Bottom 0.254: v86.36,69.22 91.12,69.22 91.76,68.58 96.68,68.58 97.63,67.63 105.09,67.63 106.68,69.22 v111.76,69.22
INSTR5  (via drill 0.6)  (1 unrouted)
  Top 0.254: v88.42,29.69 88.42,31.12 87.63,32.07 87.63,34.29 87.95,34.61 87.95,46.04 v87.31,46.67 | v89.85,46.67 89.85,46.99 87.63,49.21 87.63,67.31 v88.27,67.95 | v96.2,67.63 99.06,67.63 v102.23,70.8
  Bottom 0.254: K19.5 84.5,26.08 v88.42,29.69 | v87.31,46.67 v89.85,46.67 | v88.27,67.95 91.44,67.95 91.76,67.63 v96.2,67.63 | v102.23,70.8 101.12,71.91 101.12,74.45 119.89,74.45 K79.6
INSTR6  (via drill 0.6, 0.61)
  Top 0.254: v88.27,107.95 D48.A | K80.6 127.97,73.37 129.54,74.93 129.54,81.28 130.49,82.23 130.49,82.55 129.22,83.82 128.59,83.82 127.32,85.09 127.32,88.27 v125.73,89.85 | v115.89,91.12 115.89,95.25 v115.57,95.57 | v101.92,95.25 101.6,95.25 101.28,95.57 v101.28,104.14 | v94.93,104.14 v94.93,107.63
  Bottom 0.254: D32.A 52.71,109.22 57.79,109.22 59.05,107.95 81.91,107.95 | 81.91,107.95 83.19,106.68 83.19,103.51 81.91,103.51 K100.1 | 81.91,107.95 v88.27,107.95 88.58,107.63 v94.93,107.63 | v125.73,89.85 117.16,89.85 v115.89,91.12 | v115.57,95.57 112.39,95.57 112.08,95.25 v101.92,95.25 | v101.28,104.14 v94.93,104.14
INSTR7  (via drill 0.61)
  Top 0.254: v136.53,116.84 136.53,92.71 137.8,91.44 137.8,83.82 137.16,83.19 137.16,75.57 135.26,73.66 K81.6 | v93.98,118.11 92.71,116.84 v92.71,104.78 | D40.A 71.75,110.49 71.75,104.78 70.48,103.51 K99.1
  Bottom 0.254: D31.A 49.53,112.4 69.85,112.4 D40.A | v136.53,116.84 134.62,118.75 94.61,118.75 v93.98,118.11 | v92.71,104.78 92.71,104.3 89.53,101.12 89.06,101.12 88.42,100.49 78.9,100.49 78.42,100.97 72.39,100.97 70.48,102.87 K99.1
LATCH_A  (via drill 0.61)
  Top 0.254: D39.C D38.C | D41.C 72.39,113.67 | 72.39,113.67 D40.C | 150.5,70.48 145.42,70.48 144.15,71.76 144.15,72.39 142.88,73.66 K85.3 | 150.5,70.48 150.5,72.39 149.23,73.66 K86.3 | 150.5,70.48 155.58,70.48 156.84,71.76 156.84,72.39 155.58,73.66 K87.3 | 72.39,113.67 72.39,101.6 v80.01,93.98 | v109.22,88.27 v106.05,91.44 | v171.45,87.63 173.36,85.73 173.36,71.76 172.09,70.48 170.18,70.48 170.18,72.39 168.91,73.66 K89.3
  Bottom 0.254: D40.C D39.C | 158.75,77.47 161.93,74.3 K88.3 | 158.75,77.47 158.12,77.47 154.94,74.3 K87.3 | 158.75,77.47 167.01,77.47 167.01,75.57 168.28,74.3 K89.3 | v80.01,93.98 82.55,91.44 v106.05,91.44 | v109.22,88.27 109.85,87.63 v171.45,87.63
LATCH_INSTR  (via drill 0.61)
  Top 0.254: D30.C D29.C v43.18,114.94 | K77.3 103.5,73.03 103.19,73.03 101.28,71.28 101.28,70.8 100.49,69.85 98.42,69.85 98.42,71.76 97.16,73.03 K76.3 | v32.38,118.11 1.27,118.11 1.27,9.53 8.26,2.54 24.77,2.54 v24.77,34.92 | v73.02,46.99 v60.33,34.29 | v92.71,53.34 92.71,59.69 91.44,60.96 91.44,61.59 92.08,62.23 v92.08,69.85
  Bottom 0.254: 112.39,70.48 112.39,69.85 114.3,69.85 | 112.39,70.48 112.39,71.76 111.12,73.03 K78.3 | 114.3,69.85 117.47,73.03 K79.3 | 121.28,69.85 124.46,73.03 K80.3 | 114.3,69.85 121.28,69.85 | 121.28,69.85 128.27,69.85 131.45,73.03 K81.3 | K74.3 83.19,73.66 84.45,74.93 84.45,76.84 86.36,76.84 89.53,73.66 K75.3 89.53,73.03 92.08,70.48 | 94.61,71.12 93.34,69.85 92.71,69.85 92.08,70.48 | 94.61,71.12 96.52,73.03 K76.3 | v43.18,114.94 41.91,116.2 38.89,116.2 38.26,115.57 37.78,115.57 36.51,116.84 33.66,116.84 v32.38,118.11 | v24.77,34.92 25.4,34.29 v60.33,34.29 | v73.02,46.99 77.47,51.43 88.9,51.43 90.8,53.34 v92.71,53.34 | 92.08,70.48 v92.08,69.85 | 112.39,70.48 111.76,70.48 111.12,69.85 106.52,69.85 104.93,68.26 97.79,68.26 96.84,69.22 96.52,69.22 94.61,71.12
LATCH_PC-  (via drill 0.61)
  Top 0.254: K13.1 50.17,41.91 51.44,40.64 51.44,22.86 50.17,21.59 48.9,21.59 48.9,23.5 K9.1 | D42.C D43.C 80.01,113.67 | 80.01,113.67 D44.C D45.C | v78.42,61.12 78.1,60.8 v78.1,33.66 | 80.01,113.67 80.01,95.25 81.28,93.98 v81.28,76.84 | v81.28,63.98 81.28,61.59 K14.1
  Bottom 0.254: 53.98,27.31 57.15,24.13 K11.1 57.79,24.13 60.96,27.31 62.87,27.31 | 62.87,27.31 66.04,24.13 K15.1 66.67,24.13 69.85,27.31 K17.7 72.39,27.31 | 62.87,27.31 K15.7 | K5.7 27.3,27.31 30.48,24.13 K5.1 31.11,24.13 34.29,27.31 36.2,27.31 | 36.2,27.31 39.37,24.13 K7.1 40.01,24.13 43.18,27.31 45.09,27.31 | 36.2,27.31 K7.7 | 45.09,27.31 48.26,24.13 K9.1 48.9,24.13 50.8,24.13 53.98,27.31 | 45.09,27.31 K9.7 | 53.98,27.31 K11.7 | 72.39,27.31 75.56,24.13 K17.1 | 78.1,33.02 74.93,33.02 73.66,31.75 73.66,27.31 72.39,27.31 | 78.1,33.02 80.01,33.02 80.64,33.66 K19.1 | v78.42,61.12 78.74,60.96 K14.1 | 78.1,33.02 v78.1,33.66 | v81.28,63.98 v81.28,76.84
LATCH_RESULT
  Top 0.254: D37.C D36.C
  Bottom 0.254: 196.85,95.89 196.85,90.81 195.58,89.54 194.95,89.54 193.68,88.27 K90.3 | 196.85,95.89 194.95,95.89 193.68,94.62 K91.3 | 195.58,102.23 194.95,102.23 193.68,100.97 K92.3 | 195.58,102.23 196.85,100.97 196.85,95.89 | 195.58,108.59 194.95,108.59 193.68,107.32 K93.3 | 195.58,108.59 196.85,107.32 196.85,102.23 195.58,102.23 | 195.58,108.59 196.85,108.59 196.85,113.67 195.58,114.94 194.95,114.94 193.68,113.67 K94.3 193.04,113.67 192.41,113.67 186.69,119.38 150.5,119.38 146.69,115.57 136.53,115.57 135.89,116.2 112.39,116.2 111.76,115.57 105.41,115.57 104.77,114.94 64.77,114.94 D37.C
N$1
  Top 0.254: K1.1 10.16,15.88 R1.1 8.89,12.06 C1.+
N$2  (via drill 0.61)
  Top 0.254: v34.29,19.05 34.29,27.31 36.2,29.21 K7.6
  Bottom 0.254: v34.29,19.05 31.75,19.05 31.11,18.42 K6.3
N$3  (via drill 0.61)
  Top 0.254: v40.64,22.86 41.28,23.5 41.28,27.94 40.01,29.21 K7.3
  Bottom 0.254: v40.64,22.86 33.66,22.86 31.11,20.32 K6.4
N$5  (via drill 0.61)
  Top 0.254: v15.24,29.21 14.61,29.85 14.61,31.75 15.88,33.02 K2.6
  Bottom 0.254: v15.24,29.21 10.16,29.21 7.62,26.67 7.62,24.13 K1.5
N$6
  Bottom 0.254: K1.6 6.98,22.23 5.71,23.5 5.71,29.85 14.61,29.85 15.24,30.48 15.88,29.85 16.51,29.85 19.68,33.02 K2.3
N$7  (via drill 0.61)
  Top 0.254: D38.A 68.58,108.59 v68.58,100.17 | v57.15,99.06 53.34,102.87 K97.3
  Bottom 0.254: v68.58,100.17 67.47,99.06 v57.15,99.06
N$8  (via drill 0.61)
  Top 0.254: v133.35,79.38 132.08,80.65 132.08,87 127.63,91.44 127.63,96.52 v124.46,99.7 | K63.9 119.38,116.2 119.38,103.51 120.65,102.23 K63.16
  Bottom 0.254: R26.2 116.84,100.33 120.02,100.33 K63.16 v124.46,99.7 | v133.35,79.38 133.99,80.01 135.26,80.01 137.16,78.11 144.15,78.11 144.15,75.57 145.42,74.3 K85.6
N$9
  Top 0.254: D37.A 60.33,107.95 60.33,106.05 57.79,103.51 57.79,102.87 58.42,102.23 58.42,100.33 61.6,100.33 64.14,102.87 K98.3
  Bottom 0.254: D35.A 59.69,109.86 62.23,109.86 | D37.A 62.23,109.86 | D42.A 74.93,109.86 62.23,109.86
N$10
  Top 0.254: 17.78,24.77 17.78,26.04 16.51,27.31 K2.8 | 17.78,24.77 17.78,23.5 16.51,22.23 K3.6 | 17.78,24.77 20.95,27.94 20.95,33.66 19.68,34.92 K2.4
N$11  (via drill 0.61)
  Top 0.254: v26.67,26.04 26.04,26.67 26.04,31.75 27.3,33.02 32.38,33.02 32.38,31.12 31.11,29.85 K5.3
  Bottom 0.254: v26.67,26.04 21.59,26.04 19.68,24.13 K3.4
N$12
  Bottom 0.254: K3.3 19.05,22.23 17.78,23.5 17.78,26.67 24.77,26.67 27.3,29.21 K5.6
N$13  (via drill 0.61)
  Top 0.254: v88.9,45.72 88.9,46.35 86.99,48.26 86.99,68.58 87.63,69.22 87.63,71.12 86.36,72.39 86.36,73.03 K74.6 85.72,73.66 84.45,74.93 84.45,90.81 88.9,95.25 88.9,96.68 89.38,97.16 v89.38,100.01 | v73.66,99.06 73.66,97.79 73.02,97.16 K21.8 | v102.23,100.33 106.05,96.52 109.22,96.52 109.22,97.79 K83.5 | v44.61,105.41 45.09,104.78 45.09,100.97 49.53,96.52 v49.53,94.62
  Bottom 0.254: v88.9,45.72 81.28,45.72 80.01,44.45 44.45,44.45 42.55,42.54 K13.4 | v73.66,99.06 74.93,100.33 77.47,100.33 78.1,99.7 87.95,99.54 88.42,100.01 v89.38,100.01 90.01,100.33 v102.23,100.33 | v44.61,105.41 38.42,105.41 37.78,104.78 22.22,104.78 20.95,106.05 K95.3 | v49.53,94.62 57.79,94.62 58.42,95.25 58.42,97.16 67.31,97.16 69.21,95.25 70.48,95.25 71.75,96.52 72.39,96.52 K21.8
N$14
  Top 0.254: K19.2 81.28,30.48 82.55,31.75 82.55,45.72 81.28,46.99 K55.1
N$15
  Top 0.254: K12.3 57.79,18.42 60.96,21.59 60.96,27.31 62.87,29.21 K15.6
N$16
  Top 0.254: K54.1 104.77,64.77 104.77,62.86 105.41,62.23 105.41,55.88 107.31,55.88 107.95,55.24 107.95,36.83 111.76,33.02 K56.1 111.76,32.38 111.76,31.12 108.58,27.94 108.58,1.27 34.93,1.27 32.38,3.81 32.38,5.71 29.21,8.89 29.21,12.7 25.4,16.51 25.4,32.38 26.04,33.02 26.04,43.81 46.36,43.81 47.62,42.54 47.62,40.64 46.36,39.37 K13.7
N$17
  Top 0.254: K12.4 57.79,20.32 60.33,22.86 60.33,30.48 62.87,33.02 67.94,33.02 67.94,31.12 66.67,29.85 K15.3
N$18  (via drill 0.61)
  Top 0.254: R4.2 30.48,12.06 K6.1 30.48,12.7 29.21,13.97 29.21,18.42 27.94,19.69 K6.5 27.94,20.32 27.94,22.86 29.84,24.77 29.84,26.67 30.48,27.31 K5.2 31.11,27.31 31.11,27.94 33.02,29.85 33.02,33.02 v40.64,40.64
  Bottom 0.254: v40.64,40.64 42.55,40.64 43.82,41.91 K13.3
N$19
  Top 0.254: K6.6 27.3,18.42 26.04,19.69 26.04,22.23 27.3,23.5 K5.8 27.94,24.13 29.21,25.4 29.21,29.85 30.48,31.12 K5.4
N$20  (via drill 0.61)
  Top 0.254: v76.83,40.64 77.47,41.27 v77.47,73.03 | 74.93,83.82 v75.56,84.45 | 74.93,83.82 74.93,76.2 73.02,74.3 K22.8 | v75.56,97.16 74.93,96.52 74.93,83.82 | v26.04,97.79 20.95,102.87 K95.6
  Bottom 0.254: v76.83,40.64 43.82,40.64 42.55,39.37 K13.5 | 76.83,73.66 v77.47,73.03 | 76.83,73.66 73.02,73.66 K22.8 | v75.56,84.45 73.66,84.45 73.02,85.09 K23.8 | 76.83,73.66 81.28,78.11 81.91,77.47 91.44,77.47 91.44,74.93 92.71,73.66 K75.6 | K83.4 106.05,97.79 87.63,97.79 86.99,97.16 v75.56,97.16 74.93,97.79 v26.04,97.79
N$21
  Top 0.254: K13.2 46.36,40.64 41.91,40.64 34.93,33.66 34.93,30.48 33.02,28.58 33.02,4.45 94.61,4.45 95.25,5.08 95.25,22.86 98.42,26.04 98.42,31.12 99.69,32.38 K53.1
N$22  (via drill 0.61)
  Top 0.254: 107.31,85.09 114.3,92.08 114.3,103.51 v115.57,104.78 | 107.31,85.09 106.68,84.45 106.68,83.19 101.92,78.42 101.92,75.25 100.33,73.66 K76.6 | v29.84,109.22 31.75,107.32 31.75,106.68 K96.3 | v65.41,52.7 65.41,62.86 62.23,66.04 | 62.23,66.04 59.05,69.22 53.98,69.22 53.98,72.39 50.8,75.57 50.8,98.43 45.72,103.51 v45.72,106.36 | v104.14,88.27 107.31,85.09 | 62.23,66.04 v62.23,81.92
  Bottom 0.254: v115.57,104.78 114.3,106.05 112.39,106.05 109.22,109.22 K84.5 | D2.A 14.61,109.22 v29.84,109.22 36.2,109.22 38.1,107.32 44.45,107.32 v45.72,106.36 | v65.41,52.7 80.01,52.7 80.64,53.34 K14.4 | v104.14,88.27 89.53,88.27 88.27,89.54 80.01,89.54 78.74,88.27 80.01,87 80.01,83.19 65.41,83.19 64.14,81.92 v62.23,81.92
N$23
  Top 0.254: R5.2 39.37,12.06 K8.1 39.37,12.7 38.1,13.97 38.1,18.42 36.83,19.69 K8.5 36.83,20.32 36.83,21.59 | 36.83,21.59 36.83,22.86 38.74,24.77 38.74,26.67 39.37,27.31 K7.2 | 36.83,21.59 40.64,21.59 41.91,22.86 41.91,36.83 43.82,38.73 K13.6
N$24
  Top 0.254: K8.6 36.2,18.42 34.93,19.69 34.93,22.23 36.2,23.5 K7.8 36.83,24.13 38.1,25.4 38.1,29.85 39.37,31.12 K7.4
N$25  (via drill 0.61)
  Top 0.254: v33.02,99.06 32.38,99.7 32.38,102.87 K96.6 | v79.38,41.27 79.38,48.26 81.91,48.26 83.82,50.16 83.82,53.34 K14.5 | v109.85,36.83 111.76,38.73 111.76,57.78 113.03,59.05 114.94,59.05 114.94,64.77 108.58,71.12 | 108.58,71.12 107.31,72.39 107.31,73.03 K77.6 | v100.96,107.95 100.33,107.32 100.33,82.55 v101.44,81.12 | 108.58,71.12 v108.58,78.74 | v2.54,52.7 v2.54,99.7
  Bottom 0.254: v33.02,99.06 25.4,99.06 24.13,100.33 14.61,100.33 D1.A 12.7,99.7 v2.54,99.7 | 79.38,37.46 v79.38,41.27 | 79.38,37.46 88.27,37.46 90.17,35.56 92.08,35.56 93.34,36.83 v109.85,36.83 | v100.96,107.95 104.77,107.95 106.05,109.22 K84.4 | v101.44,81.12 103.82,80.96 105.89,79.22 106.52,79.85 107.47,79.85 v108.58,78.74 | v2.54,52.7 10.64,43.97 15.56,43.97 16.35,43.18 36.2,43.18 41.91,37.46 79.38,37.46
N$26  (via drill 0.61)
  Top 0.254: v74.93,57.78 74.93,43.18 74.14,42.39 74.14,38.58 74.93,37.78 74.93,33.66 76.83,31.75 76.83,28.58 v77.47,27.94 | v160.02,6.98 160.02,27.94 161.29,29.21 161.29,31.75 160.66,32.38 K58.1 | v126.36,33.66 127,34.29 127,34.92 128.91,36.83 137.8,36.83 v137.8,37.46 | v153.67,35.56 153.67,64.14 153.03,64.77 K52.1
  Bottom 0.254: K49.1 116.84,65.41 118.11,66.68 128.91,66.68 129.54,67.31 139.86,67.31 140.65,66.52 144.46,66.52 145.26,67.31 150.5,67.31 152.4,65.41 K52.1 | v74.93,57.78 K14.2 | v77.47,27.94 81.28,24.13 82.55,24.13 90.17,16.51 90.17,1.27 148.59,1.27 154.31,6.98 v160.02,6.98 | v126.36,33.66 125.09,33.66 124.46,33.02 K57.1 | v137.8,37.46 138.43,36.83 147.32,36.83 149.86,34.29 153.67,34.29 | 153.67,34.29 156.84,34.29 158.12,33.02 160.02,33.02 K58.1 | 153.67,34.29 v153.67,35.56
N$27
  Top 0.254: K8.3 40.01,18.42 43.18,21.59 43.18,27.31 45.09,29.21 K9.6
N$28  (via drill 0.61)
  Top 0.254: v50.17,22.86 50.17,27.94 48.9,29.21 K9.3
  Bottom 0.254: v50.17,22.86 42.55,22.86 40.01,20.32 K8.4
N$29  (via drill 0.61)
  Top 0.254: K51.1 177.17,64.77 184.15,57.78 184.15,33.02 K62.1 | v127,59.05 127,63.5 128.27,64.77 K47.1 | v144.78,59.05 146.05,57.78 146.05,34.92 147.96,33.02 K60.1 | v140.34,69.06 140.34,65.41 K48.1
  Bottom 0.254: K51.1 176.53,65.41 175.26,66.68 166.37,66.68 165.1,65.41 K50.1 164.47,65.41 160.66,69.22 140.49,69.22 v140.34,69.06 | K61.1 172.09,34.61 172.4,34.92 182.25,34.92 184.15,33.02 K62.1 | K59.1 136.53,33.02 137.8,34.29 146.69,34.29 147.96,33.02 K60.1 | K14.7 84.45,57.78 85.09,58.42 100.33,58.42 100.96,59.05 106.68,59.05 107.31,58.42 108.58,58.42 109.22,59.05 118.74,59.05 119.54,58.26 121.13,58.26 121.92,59.05 v127,59.05 127.63,58.42 129.54,58.42 130.18,59.05 137.8,59.05 138.43,58.42 139.7,58.42 140.34,59.05 v144.78,59.05 | K48.1 140.34,65.41 139.06,66.68 130.18,66.68 128.91,65.41 K47.1
N$30  (via drill 0.61)
  Top 0.254: R8.2 66.04,12.06 K16.1 66.04,12.7 64.77,13.97 64.77,18.42 63.5,19.69 K16.5 63.5,20.32 63.5,22.86 65.41,24.77 65.41,26.67 66.04,27.31 K15.2 | v82.55,22.86 82.55,26.67 81.28,27.94 K19.3
  Bottom 0.254: v82.55,22.86 66.04,22.86 63.5,20.32 K16.5
N$31  (via drill 0.61)
  Top 0.254: R6.2 48.26,12.06 K10.1 48.26,12.7 46.99,13.97 46.99,18.42 45.72,19.69 K10.5 45.72,20.32 45.72,22.86 47.62,24.77 47.62,26.67 48.26,27.31 K9.2 | v71.12,53.98 52.71,35.56 v52.71,31.12
  Bottom 0.254: v71.12,53.98 71.75,53.34 78.74,53.34 80.64,55.24 K14.3 | v52.71,31.12 48.9,27.31 K9.2
N$32
  Top 0.254: K10.6 45.09,18.42 43.82,19.69 43.82,22.23 45.09,23.5 K9.8 45.72,24.13 46.99,25.4 46.99,29.85 48.26,31.12 K9.4
N$33
  Top 0.254: K16.6 62.87,18.42 61.6,19.69 61.6,22.23 62.87,23.5 K15.8 63.5,24.13 64.77,25.4 64.77,29.85 66.04,31.12 K15.4
N$34
  Top 0.254: K16.3 66.67,18.42 69.85,21.59 69.85,27.31 71.75,29.21 K17.6
N$35
  Top 0.254: K10.3 48.9,18.42 52.07,21.59 52.07,27.31 53.98,29.21 K11.6
N$36  (via drill 0.61)
  Top 0.254: v57.15,22.23 59.05,24.13 v59.05,27.94
  Bottom 0.254: v57.15,22.23 50.8,22.23 48.9,20.32 K10.4 | v59.05,27.94 57.79,29.21 K11.3
N$38  (via drill 0.61)
  Top 0.254: v76.2,21.59 77.15,22.54 77.15,26.99 75.56,28.58 75.56,29.21 K17.3
  Bottom 0.254: v76.2,21.59 67.94,21.59 66.67,20.32 K16.4
N$39  (via drill 0.61)
  Top 0.254: R7.2 57.15,12.06 K12.1 57.15,12.7 55.88,13.97 55.88,18.42 54.61,19.69 K12.5 54.61,20.32 54.61,22.86 56.52,24.77 56.52,26.67 57.15,27.31 K11.2 57.79,27.31 57.79,27.94 59.05,29.21 59.05,40 v66.04,46.99
  Bottom 0.254: v66.04,46.99 71.12,52.07 82.55,52.07 82.55,53.98 83.82,55.24 K14.6
N$40
  Top 0.254: K12.6 53.98,18.42 52.71,19.69 52.71,22.23 53.98,23.5 K11.8 54.61,24.13 55.88,25.4 55.88,29.85 57.15,31.12 K11.4
N$41
  Top 0.254: K73.1 81.28,20.96 83.19,20.96 83.19,22.23 85.72,24.77 85.72,29.21 84.45,30.48 K19.7
N$42
  Bottom 0.254: LED1.A 11.43,40 R3.1
N$43
  Bottom 0.254: R2.1 21.59,41.27 LED2.A
N$44
  Top 0.254: R9.2 74.93,12.06 K18.1 74.93,12.7 73.66,13.97 73.66,18.42 72.39,19.69 | 72.39,19.69 76.52,23.65 76.52,26.35 75.56,27.31 K17.2 | 72.39,19.69 K18.5
  Bottom 0.254: K19.6 83.82,28.58 82.55,29.85 82.55,31.75 80.01,31.75 75.56,27.31 K17.2
N$45
  Top 0.254: K18.6 71.75,18.42 70.48,19.69 70.48,22.23 71.75,23.5 K17.8 72.39,24.13 72.39,26.04 73.66,27.31 73.66,29.85 74.93,31.12 K17.4
N$50
  Top 0.254: R10.1 LED9.A
N$51
  Top 0.254: D43.A 79.38,110.49 79.38,106.05 76.2,102.87 K99.3
  Bottom 0.254: D47.A 87.63,112.4 80.01,112.4 D43.A
N$52
  Top 0.254: D44.A 83.19,109.22 83.19,104.78 85.72,104.78 86.99,103.51 K100.3
  Bottom 0.254: D41.A 74.93,112.4 76.83,112.4 77.47,111.76 77.47,109.86 80.01,109.86 D44.A
N$53
  Top 0.254: LED3.A 27.94,8.26 R4.1
N$54
  Top 0.254: LED4.A 36.83,8.26 R5.1
N$55
  Top 0.254: LED5.A 45.72,8.26 R6.1
N$56
  Top 0.254: LED6.A 54.61,8.26 R7.1
N$57
  Top 0.254: LED7.A 63.5,8.26 R8.1
N$58
  Top 0.254: LED8.A 72.39,8.26 R9.1
N$59
  Top 0.254: R11.1 LED10.A
N$60
  Top 0.254: R12.1 LED11.A
N$61
  Top 0.254: R13.1 LED12.A
N$62
  Top 0.254: K22.3 69.21,68.58 67.94,69.85 67.94,87 69.21,88.27 69.21,88.9 K21.4
N$63  (via drill 0.61)
  Top 0.254: v77.47,90.17 77.47,87 78.1,86.36 78.1,80.01 76.2,78.11 76.2,68.26 75.56,67.63 73.5,67.63 72.87,68.26 K22.6
  Bottom 0.254: v77.47,90.17 73.02,94.62 72.39,94.62 71.12,93.34 K21.2
N$64  (via drill 0.61)
  Top 0.254: LED34.A 148.59,80.01 K86.1 148.59,79.38 147.32,78.11 147.32,73.66 148.59,72.39 K86.4 | v182.72,95.89 180.98,94.46 v180.98,80.65
  Bottom 0.254: v182.72,95.89 191.77,95.89 193.04,97.16 K91.6 | v180.98,80.65 178.44,78.11 151.13,78.11 149.86,79.38 149.23,79.38 K86.1
N$65  (via drill 0.61)
  Top 0.254: v13.33,73.03 13.33,76.84 14.61,78.11 K35.4 | v55.25,71.76 55.25,76.2 56.52,77.47 56.52,78.11 K40.4
  Bottom 0.254: 55.25,72.39 56.52,72.39 57.15,71.76 64.14,71.76 65.41,70.48 K22.2 | 55.25,72.39 45.72,72.39 44.45,71.12 41.91,71.12 41.28,71.76 K39.1 | K40.4 56.52,78.11 54.61,78.11 53.34,76.84 46.99,76.84 45.72,78.11 K38.4 45.09,78.74 42.55,81.28 37.47,81.28 34.93,78.74 34.93,76.84 24.77,76.84 | v13.33,73.03 11.43,73.03 10.79,72.39 K36.1 | 24.77,76.84 26.04,78.11 K37.4 | 24.77,76.84 16.51,76.84 15.24,78.11 K35.4 | v55.25,71.76 55.25,72.39
N$66
  Bottom 0.254: 13.97,64.14 15.24,65.41 K20.4 | 13.97,64.14 10.79,60.96 K24.1 | 13.97,64.14 24.77,64.14 26.04,65.41 K25.4 26.67,65.41 27.94,64.14 36.2,64.14 39.37,60.96 40.64,60.96 K33.1 41.28,60.96 44.45,64.14 | 44.45,64.14 45.72,65.41 K32.4 | 55.25,64.14 56.52,65.41 K34.4 | 44.45,64.14 55.25,64.14 | 55.25,64.14 70.48,64.14 72.39,66.04 K22.5
N$67  (via drill 0.61)
  Top 0.254: v58.42,55.24 57.15,53.98 57.15,52.07 K31.4
  Bottom 0.254: 11.43,50.16 12.7,51.43 14.61,51.43 K26.4 | 11.43,50.16 10.79,49.53 K27.1 | 11.43,50.16 24.77,50.16 26.04,51.43 K28.4 26.67,51.43 27.94,50.16 36.83,50.16 37.47,50.8 40.64,50.8 | 40.64,50.8 40.64,51.43 41.28,51.43 41.91,52.07 45.09,52.07 K29.4 45.72,51.43 46.99,50.16 55.25,50.16 56.52,51.43 K31.4 | 40.64,50.8 40.64,49.53 K30.1 | v58.42,55.24 64.14,55.24 72.39,63.5 75.56,63.5 75.56,69.37 74.45,70.48 K22.7
N$68  (via drill 0.61)
  Top 0.254: v66.67,80.65 67.31,81.28 v67.31,87.63
  Bottom 0.254: v66.67,80.65 68.58,80.65 69.21,80.01 K23.3 | v67.31,87.63 71.12,87.63 72.39,88.9 K21.5
N$69
  Top 0.254: K23.6 73.02,80.01 74.3,81.28 74.3,92.08 73.02,93.34 K21.7
N$70
  Bottom 0.254: K83.6 109.85,100.33 112.39,102.87 116.84,102.87 R27.2 126.36,101.6 K63.1
N$71
  Bottom 0.254: K35.6 17.14,74.93 18.41,73.66 26.67,73.66 27.94,74.93 K37.6 28.57,74.93 29.84,73.66 48.9,73.66 | 48.9,73.66 47.62,74.93 K38.6 | 48.9,73.66 56.52,73.66 57.79,74.93 58.42,74.93 K40.6 59.05,74.93 60.33,73.66 65.41,73.66 65.41,80.65 66.67,81.92 K23.2
N$72  (via drill 0.61)
  Top 0.254: v118.11,104.78 118.74,104.14 118.74,102.87 119.38,102.23 119.38,96.52 118.74,95.89 K64.4 | v140.97,85.09 v140.97,81.28 | v136.53,83.82 136.53,85.73 131.45,90.81 129.54,90.81 129.54,102.87 128.27,104.14 v128.27,105.41
  Bottom 0.254: v118.11,104.78 116.84,106.05 | 116.84,106.05 D6.A | v140.97,81.28 142.24,81.28 146.05,77.47 150.5,77.47 150.5,75.57 151.77,74.3 K86.6 | v140.97,85.09 139.7,83.82 v136.53,83.82 | v128.27,105.41 125.09,108.59 119.38,108.59 116.84,106.05
N$73  (via drill 0.61)
  Top 0.254: v19.68,45.72 17.14,48.26 K26.6 | v28.57,45.72 28.57,48.26 K28.6 | v65.41,71.76 66.04,71.12 66.04,53.34 66.67,52.7 64.14,50.16 59.05,50.16 59.05,48.89 K31.6
  Bottom 0.254: v19.68,45.72 20.32,46.35 28.57,46.35 | 28.57,46.35 34.93,46.35 35.56,46.99 45.72,46.99 | 45.72,46.99 46.99,48.26 K29.6 | 28.57,46.35 v28.57,45.72 | 45.72,46.99 57.15,46.99 58.42,48.26 K31.6 | v65.41,71.76 66.04,71.12 68.58,71.12 72.39,74.93 73.02,74.93 74.3,76.2 78.1,76.2 78.1,80.01 76.83,81.28 73.66,81.28 73.02,81.92 K23.7
N$75  (via drill 0.61)
  Top 0.254: v66.67,72.39 66.67,59.69 69.21,57.15 K82.3 | v76.83,80.01 76.83,87 v76.2,87.63
  Bottom 0.254: v66.67,72.39 69.85,75.57 72.39,75.57 v76.83,80.01 | v76.2,87.63 73.02,90.81 K21.6
N$78
  Top 0.254: 71.12,83.82 71.12,75.57 69.85,74.3 K22.1 | 71.12,83.82 69.85,85.09 K23.1 | 71.12,83.82 71.12,95.25 69.85,96.52 K21.1
N$79  (via drill 0.61)
  Top 0.254: v13.33,83.82 13.33,89.54 14.61,90.81 K41.4 | v54.61,85.09 55.25,85.73 55.25,88.9 56.52,90.17 56.52,90.81 K46.4 | v78.74,71.76 79.38,72.39 79.38,86.36 v78.74,87
  Bottom 0.254: v13.33,83.82 10.79,83.82 K42.1 | K41.4 15.24,90.81 16.51,89.54 24.77,89.54 26.04,90.81 K43.4 26.67,90.81 27.94,89.54 34.29,89.54 37.47,92.71 43.18,92.71 44.45,91.44 45.09,91.44 K44.4 45.72,90.81 46.99,89.54 53.34,89.54 54.61,90.81 56.52,90.81 K46.4 | K45.1 41.28,83.82 42.55,85.09 v54.61,85.09 57.15,85.09 58.42,86.36 78.1,86.36 v78.74,87 | v78.74,71.76 71.12,71.76 71.12,67.95 69.85,66.68 K22.4
N$80  (via drill 0.61)
  Top 0.254: v66.67,79.38 64.77,81.28 64.77,83.82 62.23,86.36 59.05,86.36 59.05,87.63 K46.6
  Bottom 0.254: K41.6 17.14,87.63 18.41,86.36 26.67,86.36 27.94,87.63 K43.6 28.57,87.63 30.48,85.73 45.09,85.73 46.99,87.63 K44.6 47.62,87.63 48.9,86.36 57.15,86.36 58.42,87.63 K46.6 | v66.67,79.38 67.94,79.38 69.21,78.11 K23.4
N$81  (via drill 0.61)
  Top 0.254: JP1.16 JP1.14 JP1.12 JP1.10 JP1.8 JP1.6 JP1.4 JP1.2 | v113.66,88.9 120.65,88.9 123.83,85.73 123.83,85.09 125.09,85.09 125.73,84.45 125.73,83.19 126.36,82.55 126.36,71.12 125.73,70.48 125.73,66.04 125.09,65.41 K47.2 | v96.68,90.33 94.61,88.27 88.9,88.27 v88.9,87.63 | v80.01,88.27 80.01,72.39 80.64,71.76 80.64,65.09 79.38,63.82 79.38,60.96 82.55,57.78 v82.55,50.16
  Bottom 0.254: v113.66,88.9 112.08,90.49 105.57,90.49 105.25,90.81 97.16,90.81 v96.68,90.33 | v88.9,87.63 88.27,88.27 v80.01,88.27 | v82.55,50.16 85.09,47.62 90.8,47.62 JP1.8
N$82  (via drill 0.61)
  Top 0.254: v74.3,69.22 74.3,70.48 71.12,73.66 71.75,74.3 71.75,76.84 72.39,77.47 K23.5 | v64.14,60.96 59.05,60.96 59.05,62.23 K34.6 | K25.6 28.57,62.23 33.02,57.78 34.29,57.78 34.29,52.7 34.93,52.07 34.93,46.35 34.29,45.72 35.56,44.45 43.18,44.45 43.18,55.88 46.99,59.69 46.99,62.23 K32.6
  Bottom 0.254: K20.6 17.14,62.23 18.41,60.96 26.67,60.96 27.94,62.23 K25.6 | K32.6 47.62,62.23 48.9,60.96 57.15,60.96 58.42,62.23 K34.6 | v74.3,69.22 74.3,65.09 73.34,64.14 71.75,64.14 71.12,63.5 66.67,63.5 v64.14,60.96
N$83
  Top 0.254: R14.2 22.86,66.04 K20.1
  Bottom 0.254: 15.88,67.31 17.14,66.04 K20.3 | 15.88,67.31 13.33,69.85 8.89,69.85 7.62,68.58 K24.5 | 15.88,67.31 20.95,67.31 22.22,66.04 K20.1
N$84
  Top 0.254: R10.2 22.22,53.34 22.22,52.07 K26.1
  Bottom 0.254: R10.2 17.14,53.98 | 17.14,53.98 13.97,53.98 11.43,51.43 8.89,51.43 8.89,55.24 7.62,56.52 K27.5 | 17.14,53.98 17.14,52.07 K26.3
N$85
  Top 0.254: K24.2 10.16,64.14 8.89,62.86 8.89,48.89 13.33,44.45 24.13,44.45 24.13,60.32 26.04,62.23 K25.5
N$86  (via drill 0.61)
  Top 0.254: K25.1 33.66,66.04 33.66,67.31 R15.2 27.94,67.95 | v13.33,68.58 13.97,69.22 13.97,71.12 14.61,71.76 27.94,71.76 27.94,67.95 | 27.94,67.95 27.94,66.04 K25.3
  Bottom 0.254: v13.33,68.58 10.79,68.58 K24.4
N$87
  Bottom 0.254: K24.7 7.62,64.14 7.62,62.23 10.16,59.69 12.06,59.69 14.61,62.23 K20.5
N$88  (via drill 0.61)
  Top 0.254: v13.33,45.72 13.33,50.16 10.79,52.7 K27.2 | v25.4,44.45 26.04,45.09 26.04,48.26 K28.5
  Bottom 0.254: v13.33,45.72 14.61,44.45 v25.4,44.45
N$89
  Top 0.254: K28.1 33.66,52.07 33.66,53.34 R11.2 28.57,53.98 28.57,52.07 K28.3
  Bottom 0.254: K27.4 10.79,56.52 12.06,55.24 24.77,55.24 27.94,52.07 K28.3
N$90
  Bottom 0.254: K27.7 7.62,52.7 7.62,50.8 10.16,48.26 14.61,48.26 K26.5
N$91  (via drill 0.61)
  Top 0.254: 5.71,64.77 5.71,56.52 6.98,55.24 K27.6 | 5.71,64.77 6.98,66.04 K24.6 | 5.71,64.77 5.71,76.2 6.98,77.47 K36.6 7.62,78.11 8.89,79.38 8.89,87 8.26,87.63 8.26,88.27 7.62,88.9 K42.6 6.98,89.54 5.71,90.81 5.71,91.44 9.53,95.25 9.53,116.84 28.57,116.84 29.84,115.57 29.84,114.3 | 29.84,114.3 29.84,111.12 34.29,106.68 K96.2 | v99.06,105.41 97.79,106.68 v97.79,116.84 | 29.84,114.3 v33.66,118.11
  Bottom 0.254: v99.06,105.41 102.87,105.41 106.05,102.23 K83.2 | v97.79,116.84 97.16,116.2 52.71,116.2 50.8,118.11 v33.66,118.11
N$92  (via drill 0.61)
  Top 0.254: 12.06,64.77 12.06,56.52 10.79,55.24 K27.3 | 12.06,64.77 10.79,66.04 K24.3 | 12.06,76.2 10.79,77.47 K36.3 | 12.06,64.77 12.06,76.2 | 12.06,76.2 12.06,87.63 10.79,88.9 K42.3 10.79,89.54 12.7,91.44 12.7,110.49 v14.61,110.49 | v34.29,110.33 35.56,109.22 35.56,104.78 34.29,103.51 K96.7 | K83.7 107.95,102.23 99.06,111.12 v99.06,116.2 | v50.8,115.57 49.53,114.3 v49.53,108.59 | v38.74,109.86 v40.01,108.59
  Bottom 0.254: v14.61,110.49 34.13,110.49 v34.29,110.33 34.45,110.49 38.1,110.49 v38.74,109.86 | v99.06,116.2 98.42,115.57 v50.8,115.57 | v49.53,108.59 48.9,107.95 40.64,107.95 v40.01,108.59
N$93  (via drill 0.61)
  Top 0.254: R12.2 52.71,53.34 52.71,52.07 K29.1 | v41.91,50.8 42.55,50.16 42.55,48.26 37.47,48.26 36.2,49.53 36.2,55.24 37.47,56.52 K30.5 | v45.72,50.16 46.99,51.43 K29.3
  Bottom 0.254: R12.2 49.53,53.98 47.62,52.07 K29.3 | v41.91,50.8 42.55,50.16 v45.72,50.16
N$94
  Top 0.254: LED11.K 46.36,56.52 50.8,52.07 50.8,50.8 52.71,48.89 K29.8 | LED9.K 18.41,53.34 20.32,53.34 20.32,50.8 22.22,48.89 K26.8
  Bottom 0.254: LED12.K 55.88,57.78 46.99,57.78 LED11.K 43.18,56.52 41.28,58.42 28.57,58.42 LED10.K 25.4,57.78 16.51,57.78 LED9.K | K31.8 64.14,48.89 62.87,50.16 56.52,50.16 55.25,48.89 53.34,48.89 K29.8 | 24.13,46.99 22.86,48.26 K26.8 | 24.13,46.99 32.38,46.99 33.66,48.26 K28.8 34.29,48.89 37.47,48.89 K30.8 | 24.13,46.99 9.53,46.99 7.62,48.89 K27.8
N$95  (via drill 0.61)
  Top 0.254: JP2.2 JP2.4 JP2.6 JP2.8 JP2.10 JP2.12 JP2.14 JP2.16 v97.79,59.69 | v119.38,85.09 119.38,71.12 120.02,70.48 120.02,66.04 120.65,65.41 K47.4 | v93.98,87 93.98,79.38 94.61,78.74 94.61,66.04 92.71,64.14 v92.71,60.96
  Bottom 0.254: v119.38,85.09 117.47,87 v93.98,87 | v92.71,60.96 93.98,59.69 v97.79,59.69
N$96  (via drill 0.61)
  Top 0.254: JP3.2 JP3.4 JP3.6 JP3.8 JP3.10 | JP3.12 JP3.14 JP3.16 102.87,58.42 102.87,62.86 v103.5,63.5 | v118.74,67.95 118.74,63.5 123.83,63.5 125.09,62.23 K47.7 | v110.49,67.31 107.95,67.31 v107.95,66.68
  Bottom 0.254: v118.74,67.95 118.11,67.31 v110.49,67.31 | v107.95,66.68 104.77,63.5 v103.5,63.5 | JP3.10 102.23,49.53 100.96,50.8 102.23,52.07 JP3.12
N$97  (via drill 0.61)
  Top 0.254: v44.45,53.34 43.82,52.7 43.82,44.45 52.71,44.45 56.52,48.26 K31.5
  Bottom 0.254: v44.45,53.34 43.82,52.7 K30.2
N$98
  Top 0.254: R13.2 64.14,53.34 64.14,52.07 K31.1
  Bottom 0.254: R13.2 60.96,53.98 59.05,52.07 K31.3 58.42,52.07 55.25,55.24 42.55,55.24 41.28,56.52 K30.4
N$99  (via drill 0.61)
  Top 0.254: v39.37,49.53 39.37,51.43 38.1,52.7 K30.7
  Bottom 0.254: v39.37,49.53 40.64,48.26 45.09,48.26 K29.5
N$100  (via drill 0.61)